# EAGLE design Capsense16_25092018 (EAGLE 9.1.3)
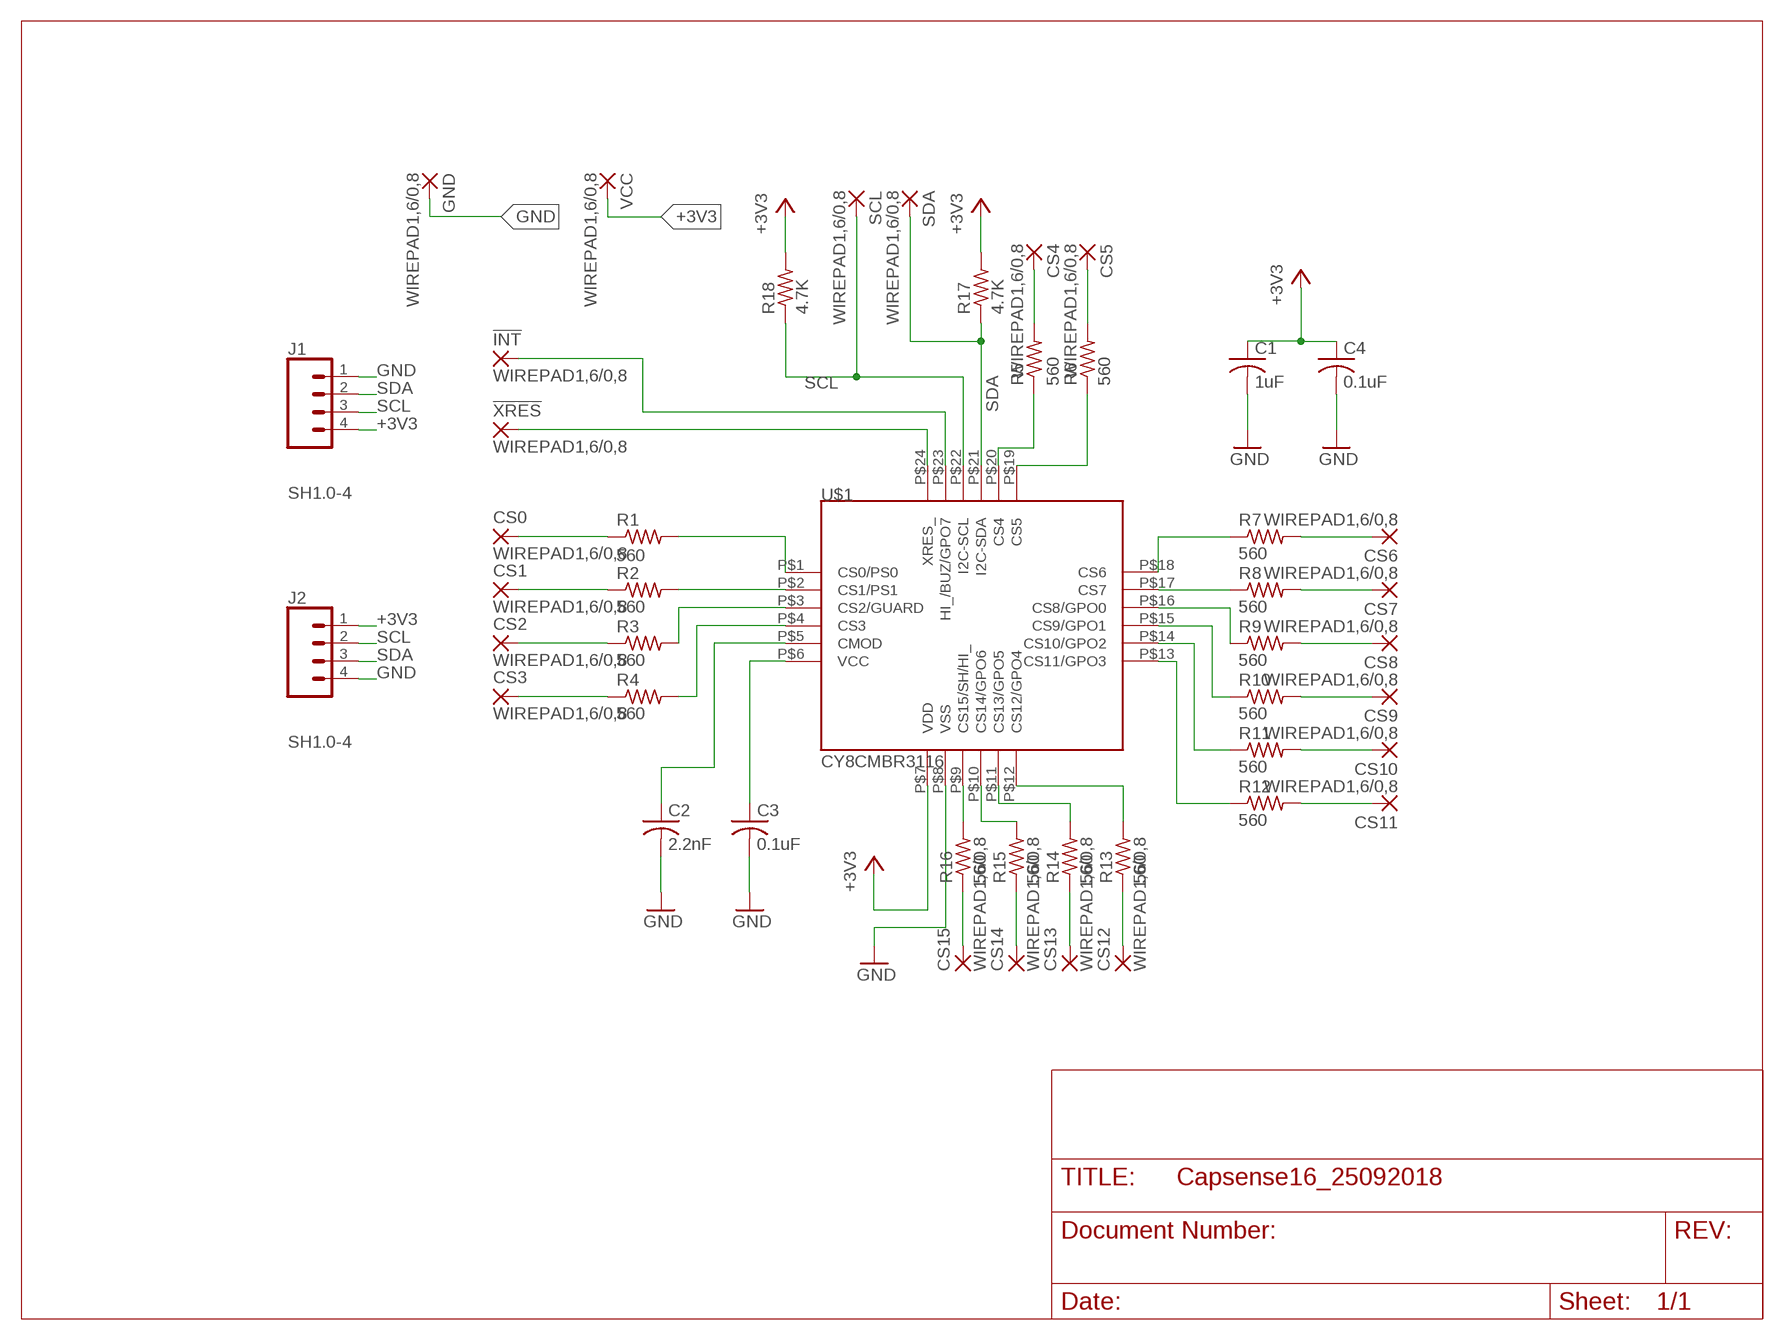
[diagram p0: schematic, sheet 1]

## Parts
!INT!  WIREPAD1,6/0,8  [1,6/0,8]
!XRES!  WIREPAD1,6/0,8  [1,6/0,8]
C1  1uF  C-USC0603  [C0603]
C2  2.2nF  C-USC0603  [C0603]
C3  0.1uF  C-USC0603  [C0603]
C4  0.1uF  C-USC0603  [C0603]
CS0  WIREPAD1,6/0,8  [1,6/0,8]
CS1  WIREPAD1,6/0,8  [1,6/0,8]
CS2  WIREPAD1,6/0,8  [1,6/0,8]
CS3  WIREPAD1,6/0,8  [1,6/0,8]
CS4  WIREPAD1,6/0,8  [1,6/0,8]
CS5  WIREPAD1,6/0,8  [1,6/0,8]
CS6  WIREPAD1,6/0,8  [1,6/0,8]
CS7  WIREPAD1,6/0,8  [1,6/0,8]
CS8  WIREPAD1,6/0,8  [1,6/0,8]
CS9  WIREPAD1,6/0,8  [1,6/0,8]
CS10  WIREPAD1,6/0,8  [1,6/0,8]
CS11  WIREPAD1,6/0,8  [1,6/0,8]
CS12  WIREPAD1,6/0,8  [1,6/0,8]
CS13  WIREPAD1,6/0,8  [1,6/0,8]
CS14  WIREPAD1,6/0,8  [1,6/0,8]
CS15  WIREPAD1,6/0,8  [1,6/0,8]
GND  WIREPAD1,6/0,8  [1,6/0,8]
J1  SH1.0-4  JST_4_PIN_HORIZONTAL  [JST-4-SMD-HORI-1.0MM]
J2  SH1.0-4  JST_4_PIN_HORIZONTAL  [JST-4-SMD-HORI-1.0MM]
R1  560  R-US_R0603  [R0603]
R2  560  R-US_R0603  [R0603]
R3  560  R-US_R0603  [R0603]
R4  560  R-US_R0603  [R0603]
R5  560  R-US_R0603  [R0603]
R6  560  R-US_R0603  [R0603]
R7  560  R-US_R0603  [R0603]
R8  560  R-US_R0603  [R0603]
R9  560  R-US_R0603  [R0603]
R10  560  R-US_R0603  [R0603]
R11  560  R-US_R0603  [R0603]
R12  560  R-US_R0603  [R0603]
R13  560  R-US_R0603  [R0603]
R14  560  R-US_R0603  [R0603]
R15  560  R-US_R0603  [R0603]
R16  560  R-US_R0603  [R0603]
R17  4.7K  R-US_R0603  [R0603]
R18  4.7K  R-US_R0603  [R0603]
SCL  WIREPAD1,6/0,8  [1,6/0,8]
SDA  WIREPAD1,6/0,8  [1,6/0,8]
U$1  CY8CMBR3116  [CY8CMBR3116]
VCC  WIREPAD1,6/0,8  [1,6/0,8]

## Nets
+3V3: C1.1 C4.1 J1.4 J2.1 R17.2 R18.2 U$1.P$7(VDD) VCC.1(P)
GND: C1.2 C2.2 C3.2 C4.2 GND.1(P) J1.1 J2.4 U$1.P$8(VSS)
N$1: R7.1 U$1.P$18(CS6)
N$2: R8.1 U$1.P$17(CS7)
N$3: R9.1 U$1.P$16(CS8/GPO0)
N$4: R10.1 U$1.P$15(CS9/GPO1)
N$5: R11.1 U$1.P$14(CS10/GPO2)
N$6: R12.1 U$1.P$13(CS11/GPO3)
N$7: R6.1 U$1.P$19(CS5)
N$8: R5.1 U$1.P$20(CS4)
N$9: R1.2 U$1.P$1(CS0/PS0)
N$10: R2.2 U$1.P$2(CS1/PS1)
N$11: R3.2 U$1.P$3(CS2/GUARD)
N$12: R4.2 U$1.P$4(CS3)
N$13: R13.2 U$1.P$12(CS12/GPO4)
N$14: R14.2 U$1.P$11(CS13/GPO5)
N$15: R15.2 U$1.P$10(CS14/GPO6)
N$16: R16.2 U$1.P$9(CS15/SH/HI_)
N$17: C2.1 U$1.P$5(CMOD)
N$18: C3.1 U$1.P$6(VCC)
N$19: !XRES!.1(P) U$1.P$24(XRES_)
N$22: CS0.1(P) R1.1
N$23: CS1.1(P) R2.1
N$24: CS2.1(P) R3.1
N$25: CS3.1(P) R4.1
N$26: CS15.1(P) R16.1
N$27: CS14.1(P) R15.1
N$28: CS13.1(P) R14.1
N$29: CS12.1(P) R13.1
N$30: CS11.1(P) R12.2
N$31: CS10.1(P) R11.2
N$32: CS9.1(P) R10.2
N$33: CS8.1(P) R9.2
N$34: CS7.1(P) R8.2
N$35: CS6.1(P) R7.2
N$36: CS4.1(P) R5.2
N$37: CS5.1(P) R6.2
N$38: !INT!.1(P) U$1.P$23(HI_/BUZ/GPO7)
SCL: J1.3 J2.2 R18.1 SCL.1(P) U$1.P$22(I2C-SCL)
SDA: J1.2 J2.3 R17.1 SDA.1(P) U$1.P$21(I2C-SDA)

## Library data of the parts
!INT! !XRES! CS0 CS1-CS15 GND SCL SDA VCC = wirepad:WIREPAD: Wire PAD connect wire on PCB
C1-C4 = rcl:C-US: CAPACITOR, American symbol; SPICEPREFIX: C
J1 J2 = T-Stick:JST_4_PIN_HORIZONTAL: JST 4 pin horizontal connector JST-SH type.
R1-R18 = rcl:R-US_: RESISTOR, American symbol; SPICEPREFIX: R
U$1 = T-Stick:CY8CMBR3116: CY8CMBR3116 QFN24 4x4

## Net classes
0 default: width 0.152 mm, drill 0.508 mm

## Board
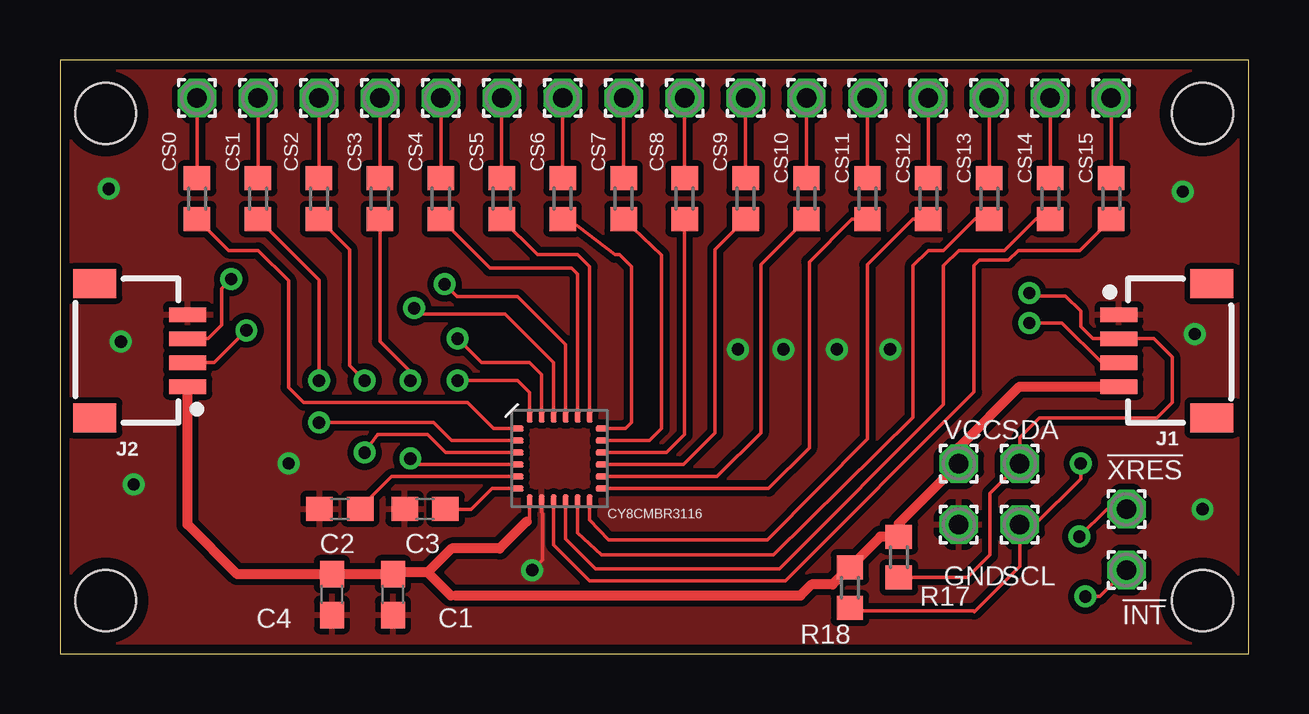
[diagram p1: board, top side]
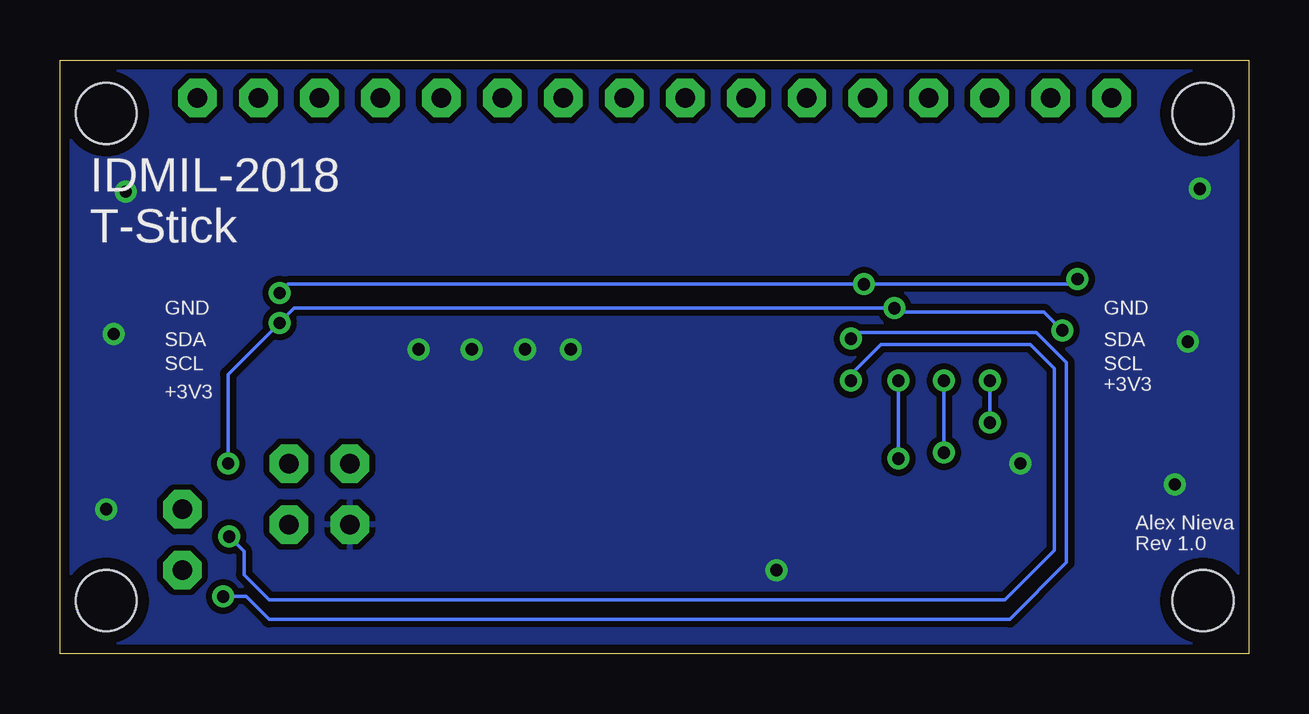
[diagram p2: board, bottom side, seen from below]

Size 49.55 x 24.77 mm. Coordinates in mm from the lower left corner, seen from the top.
Outline: 0,0 49.55,0 49.55,24.77 0,24.77 0,0
Copper layers (1*16): Top 0.035mm / dielectric 1.5mm / Bottom 0.035mm
Design rules "default *": minimum track width 6mil, minimum drill 0.35mm, track to track 10mil, track to pad 10mil, pad to pad 6mil, via to via 6mil, smd to smd 6mil, copper to edge 15mil, drill to drill 6mil, minimum pad ring 10mil, minimum via ring 8mil, stop-mask expansion 4mil, vias tented up to drill 0mil, thermal gap 10mil
Holes 2.54 mm at 1.91,2.22 1.91,22.54 47.62,22.54 47.62,2.22
tRestrict: area 0.4,0.7 to 3.4,3.7; area 46.1,0.7 to 49.1,3.7; area 46.1,21 to 49.1,24.1; area 0.4,21 to 3.4,24.1
bRestrict: area 0.4,0.7 to 3.4,3.7; area 0.4,21 to 3.4,24.1; area 46.1,21 to 49.1,24.1; area 46.1,0.7 to 49.1,3.7

### Footprints (pad centres in the part's own frame; a part is rotated, then mirrored left to right if it is on the bottom)
1,6/0,8 = drill 0.813 pad 1.6 octagon: 1 0,0
C0603 = smd 1.1 x 1: 1 -0.85,0; 2 0.85,0
JST-4-SMD-HORI-1.0MM = smd 0.6 x 1.55: 1 -2.5,-4.775; 2 -1.5,-4.775; 3 -0.5,-4.775; 4 0.5,-4.775 | smd 1.2 x 1.8: M1 -3.8,-0.9; M2 1.8,-0.9
R0603 = smd 1 x 1.1: 1 -0.85,0; 2 0.85,0
CY8CMBR3116 = smd 0.5 x 0.25: P$1 0.25,-0.75; P$2 0.25,-1.25; P$3 0.25,-1.75; P$4 0.25,-2.25; P$5 0.25,-2.75; P$6 0.25,-3.25; P$13 3.75,-3.25; P$14 3.75,-2.75; P$15 3.75,-2.25; P$16 3.75,-1.75; P$17 3.75,-1.25; P$18 3.75,-0.75 | smd 0.25 x 0.5: P$7 0.75,-3.75; P$8 1.25,-3.75; P$9 1.75,-3.75; P$10 2.25,-3.75; P$11 2.75,-3.75; P$12 3.25,-3.75; P$19 3.25,-0.25; P$20 2.75,-0.25; P$21 2.25,-0.25; P$22 1.75,-0.25; P$23 1.25,-0.25; P$24 0.75,-0.25

### Placement (x,y rotation side)
!INT!  44.45,3.49 0 top
!XRES!  44.45,6.03 0 top
C1  13.88,2.48 270 top
C2  11.66,6.05 180 top
C3  15.22,6.05 180 top
C4  11.34,2.48 270 top
CS0  5.71,23.18 0 top
CS1  8.26,23.18 0 top
CS2  10.79,23.18 0 top
CS3  13.34,23.18 0 top
CS4  15.88,23.18 0 top
CS5  18.41,23.18 0 top
CS6  20.95,23.18 0 top
CS7  23.5,23.18 0 top
CS8  26.04,23.18 0 top
CS9  28.57,23.18 0 top
CS10  31.11,23.18 0 top
CS11  33.66,23.18 0 top
CS12  36.2,23.18 0 top
CS13  38.73,23.18 0 top
CS14  41.27,23.18 0 top
CS15  43.81,23.18 0 top
GND  37.47,5.4 0 top
J1  48.91,11.64 270 top
J2  0.55,13.64 90 top
R1  5.71,18.99 270 top
R2  8.26,18.99 270 top
R3  10.79,18.99 270 top
R4  13.34,18.99 270 top
R5  15.88,18.99 90 top
R6  18.41,18.99 90 top
R7  20.95,18.99 90 top
R8  23.5,18.99 90 top
R9  26.04,18.99 90 top
R10  28.57,18.99 90 top
R11  31.11,18.99 90 top
R12  33.66,18.99 90 top
R13  36.2,18.99 270 top
R14  38.73,18.99 270 top
R15  41.27,18.99 270 top
R16  43.81,18.99 270 top
R17  34.97,4.04 90 top
R18  32.92,2.77 90 top
SCL  40.01,5.4 0 top
SDA  40.01,7.94 0 top
U$1  18.82,10.14 0 top
VCC  37.47,7.94 0 top

### Tracks (layer width: path | path; a pad name or v marks a point on that pad's centre or on a via)
+3V3
  Top 0.152: 13.94,3.39 C1.1 | 19.45,5.52 19.57,5.64 U$1.P$7 | 16.29,2.43 16.51,2.43
  Top 0.406: 19.45,5.52 18.32,4.39 16.32,4.39 15.32,3.39 | 15.32,3.39 13.94,3.39 | C1.1 C4.1 7.39,3.33 5.32,5.39 J2.1 | 16.51,2.43 30.86,2.43 31.32,2.89 32.2,2.89 R18.2 34.2,4.89 R17.2 34.97,5.44 VCC.1 37.47,8.61 39.99,11.14 J1.4 | 15.32,3.39 16.29,2.43
GND  (via drill 0.51)
  Top 0.152: U$1.P$8 20.07,5.9 20.11,5.86 20.11,3.92 v19.68,3.49
  other vias: 3.08,7.07 2.04,19.39 46.8,19.28 32.38,12.7 30.16,12.7 28.26,12.7 34.61,12.7 47.62,6.03 9.53,7.94 2.54,13.02 47.31,13.34
  pour Top: -0.41,25.08 50.12,25.08 50.12,-0.64 -0.41,-0.64
  pour Bottom: -0.54,25.2 -0.54,-0.32 50.19,-0.32 50.19,25.2
N$1
  Top 0.152: U$1.P$18 23.57,9.39 23.82,9.64 23.82,16.14 23.32,16.64 23.13,16.64 21.2,18.14 R7.1
N$2
  Top 0.152: R8.1 25.07,16.62 25.07,9.39 24.57,8.89 U$1.P$17
N$3
  Top 0.152: R9.1 26.04,9.14 25.29,8.39 U$1.P$16
N$4
  Top 0.152: R10.1 27.3,16.87 27.3,9.21 25.99,7.89 U$1.P$15
N$5
  Top 0.152: R11.1 29.21,16.23 29.21,9.21 27.39,7.39 U$1.P$14
N$6
  Top 0.152: U$1.P$13 29.54,6.89 31.23,8.59 31.23,16.35 33.02,18.14 R12.1
N$7
  Top 0.152: R6.1 19.91,16.64 21.57,16.64 22.07,16.14 U$1.P$19
N$8
  Top 0.152: R5.1 17.92,16.09 21.32,16.09 21.57,15.84 U$1.P$20
N$9
  Top 0.152: U$1.P$1 18.07,9.39 16.99,10.48 10.16,10.48 9.53,11.11 9.53,15.56 8.26,16.83 7.02,16.83 R1.2
N$10  (via drill 0.51)
  Top 0.152: v10.79,11.39 10.79,15.6 R2.2 | v10.79,9.64 15.57,9.64 16.32,8.89 U$1.P$2
  Bottom 0.152: v10.79,11.39 v10.79,9.64
N$11  (via drill 0.51)
  Top 0.152: v12.7,8.39 13.23,9.14 15.32,9.14 16.07,8.39 U$1.P$3 | R3.2 12.06,16.87 12.06,12.03 v12.7,11.39
  Bottom 0.152: v12.7,11.39 v12.7,8.39
N$12  (via drill 0.51)
  Top 0.152: U$1.P$4 14.85,7.89 v14.61,8.14 | v14.61,11.39 14.61,11.75 13.34,13.02 R4.2
  Bottom 0.152: v14.61,11.39 v14.61,8.14
N$13
  Top 0.152: R13.2 35.56,18.14 33.66,16.23 33.66,8.97 29.48,4.76 22.86,4.76 22.07,5.58 U$1.P$12
N$14
  Top 0.152: U$1.P$11 21.57,5.05 22.57,4.13 29.73,4.13 35.54,9.86 35.56,9.88 35.56,16.19 36.2,16.83 36.83,16.83 38.14,18.14 R14.2
N$15
  Top 0.152: U$1.P$10 21.07,4.8 22.32,3.55 29.98,3.55 36.83,10.4 36.83,16.19 37.47,16.83 39.37,16.83 40.68,18.14 R15.2
N$16
  Top 0.152: R16.2 42.51,16.83 39.95,16.83 39.54,16.42 38.33,16.42 38.1,16.19 38.1,10.92 30.23,3.05 22.07,3.05 20.57,4.55 U$1.P$9
N$17
  Top 0.152: U$1.P$5 13.82,7.39 12.52,6.08 C2.1
N$18
  Top 0.152: C3.1 16.09,6.03 17.14,6.03 18,6.89 U$1.P$6
N$19  (via drill 0.51)
  Top 0.152: !XRES!.1 43.63,6.03 v42.49,4.89 | U$1.P$24 19.57,10.89 19.07,11.39 v16.57,11.39
  Bottom 0.152: v42.49,4.89 41.88,4.28 41.88,3.3 40.83,2.25 10.16,2.25 8.1,4.32 8.1,11.89 9.1,12.89 15.32,12.89 16.57,11.64 v16.57,11.39
N$22
  Top 0.152: CS0.1 5.71,19.6 R1.1
N$23
  Top 0.152: CS1.1 8.26,19.95 R2.1
N$24
  Top 0.152: CS2.1 10.79,19.95 R3.1
N$25
  Top 0.152: CS3.1 13.34,19.94 R4.1
N$26
  Top 0.152: CS15.1 43.81,19.66 R16.1
N$27
  Top 0.152: CS14.1 41.27,19.57 R15.1
N$28
  Top 0.152: CS13.1 38.73,19.61 R14.1
N$29
  Top 0.152: CS12.1 36.2,19.62 R13.1
N$30
  Top 0.152: CS11.1 33.66,19.64 R12.2
N$31
  Top 0.152: CS10.1 31.11,19.51 R11.2
N$32
  Top 0.152: CS9.1 28.57,20.02 R10.2
N$33
  Top 0.152: CS8.1 26.04,20.07 R9.2
N$34
  Top 0.152: CS7.1 23.5,19.56 R8.2
N$35
  Top 0.152: CS6.1 20.95,20.06 R7.2
N$36
  Top 0.152: CS4.1 R5.2
N$37
  Top 0.152: CS5.1 R6.2
N$38  (via drill 0.51)
  Top 0.152: !INT!.1 43.35,2.39 v42.74,2.39 | v16.57,13.14 17.57,12.14 19.57,12.14 20.07,11.64 U$1.P$23
  Bottom 0.152: v16.57,13.14 16.32,13.39 8.85,13.39 7.59,12.14 7.59,3.81 9.96,1.44 40.84,1.44 41.79,2.39 v42.74,2.39
SCL  (via drill 0.51)
  Top 0.152: v14.77,14.41 15.02,14.16 18.55,14.16 20.57,12.14 U$1.P$22 | R18.1 33.05,1.8 38.07,1.8 38.11,1.76 40.01,3.65 SCL.1 40.64,5.4 42.55,7.3 v42.55,7.94 | v7.77,13.49 6.42,12.14 J2.2 | v40.4,13.8 41.77,13.8 43.42,12.14 J1.3
  Bottom 0.152: v7.77,13.49 8.54,14.26 14.61,14.26 v14.77,14.41 39.78,14.41 v40.4,13.8 42.55,11.65 v42.55,7.94
SDA  (via drill 0.51)
  Top 0.152: U$1.P$21 21.07,12.89 19.07,14.89 16.55,14.89 v16.04,15.41 | v40.4,15.05 40.52,14.92 41.91,14.92 42.55,14.29 42.55,13.65 43.05,13.14 J1.2 45.59,13.14 46.35,12.38 46.35,10.48 45.72,9.84 40.83,9.84 40.01,9.02 SDA.1 38.77,6.7 38.77,4.13 37.83,3.19 R17.1 | J2.3 6.18,13.14 6.75,13.71 6.75,15.24 v7.13,15.63
  Bottom 0.152: v40.4,15.05 40.03,15.41 v16.04,15.41 7.35,15.41 v7.13,15.63

### Text on the board
tPlace: CY8CMBR3116
bPlace: IDMIL-2018 / T-Stick | GND | GND | SDA | SDA | SCL | SCL | +3V3 | +3V3 | Alex Nieva | Rev 1.0